# Altium schematic sheet Sensor_Motor.SchDoc
size A4
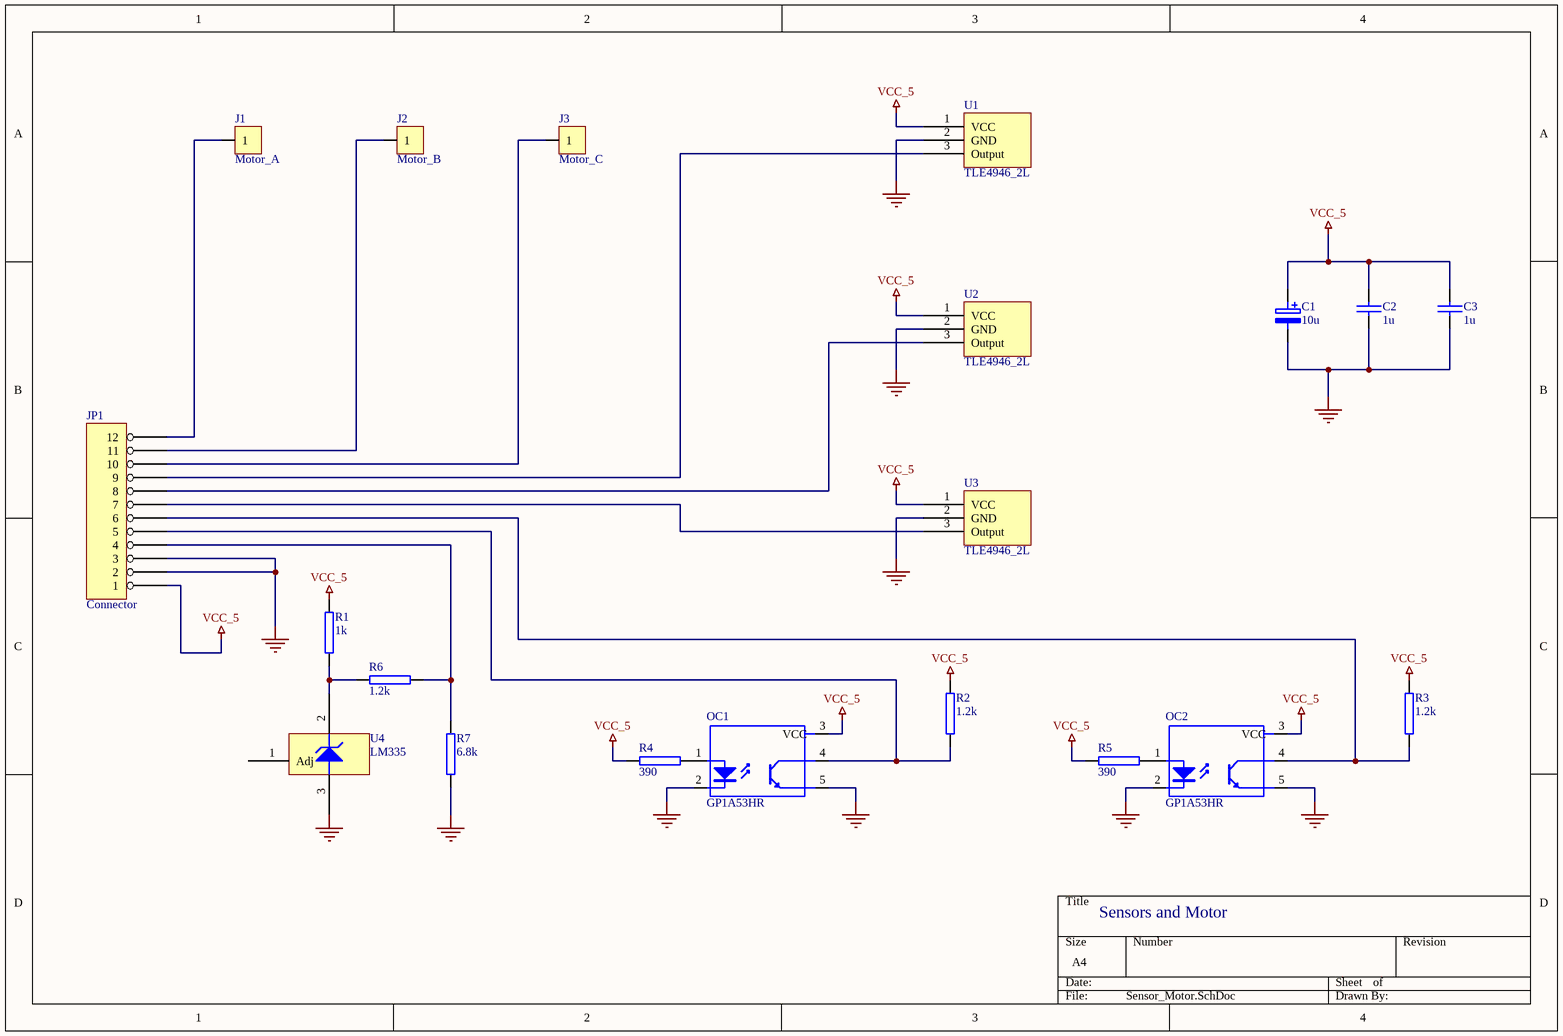
[diagram p0: Sensor_Motor.SchDoc]

## Parts
C1  10u  [M_CAPSM1]
C2  1u  [M_1206]
C3  1u  [M_1206]
J1  Motor_A  [M_SINGLE_SMD]
J2  Motor_B  [M_SINGLE_SMD]
J3  Motor_C  [M_SINGLE_SMD]
JP1  Connector  [m_sip12]
OC1  GP1A53HR  [M_PHOTO3]
OC2  GP1A53HR  [M_PHOTO3]
R1  1k  [M_1206]
R2  1.2k  [M_1206]
R3  1.2k  [M_1206]
R4  390  [M_1206]
R5  390  [M_1206]
R6  1.2k  [M_1206]
R7  6.8k  [M_1206]
U1  TLE4946_2L  [M_HALL2]
U2  TLE4946_2L  [M_HALL2]
U3  TLE4946_2L  [M_HALL2]
U4  LM335  [M_TSENSE1]

## Nets
GND: C1.2 C2.2 C3.2 JP1.2 JP1.3 OC1.2 OC1.5 OC2.2 OC2.5 R7.1 U1.2(GND) U2.2(GND) U3.2(GND) U4.3(A)
VCC_5: C1.1 C2.1 C3.1 JP1.1 OC1.3(VCC) OC2.3(VCC) R1.2 R2.2 R3.2 R4.1 R5.1 U1.1(VCC) U2.1(VCC) U3.1(VCC)
NetJ1_1: J1.1 JP1.12
NetJ2_1: J2.1 JP1.11
NetJ3_1: J3.1 JP1.10
NetJP1_4: JP1.4 R6.1 R7.2
NetJP1_5: JP1.5 OC1.4 R2.1
NetJP1_6: JP1.6 OC2.4 R3.1
NetJP1_7: JP1.7 U3.3(Output)
NetJP1_8: JP1.8 U2.3(Output)
NetJP1_9: JP1.9 U1.3(Output)
NetOC1_1: OC1.1 R4.2
NetOC2_1: OC2.1 R5.2
NetR1_1: R1.1 R6.2 U4.2(K)

Not connected (* = marked no-connect by the designer): U4 1(Adj)

## Notes on the sheet
- Sensors and Motor

## Library data of the parts
C1 = CAP_ELECTRO
C2 C3 = CAP
J1-J3 = CON1
JP1 = HEADER 12
OC1 OC2 = PHOTO_INTR
R1-R7 = RES2
U1-U3 = UGN_3503
U4 = LM_335